# Altium schematic sheet PLD_Connectors.SchDoc: Connectors
size A3; SheetTotal: 32
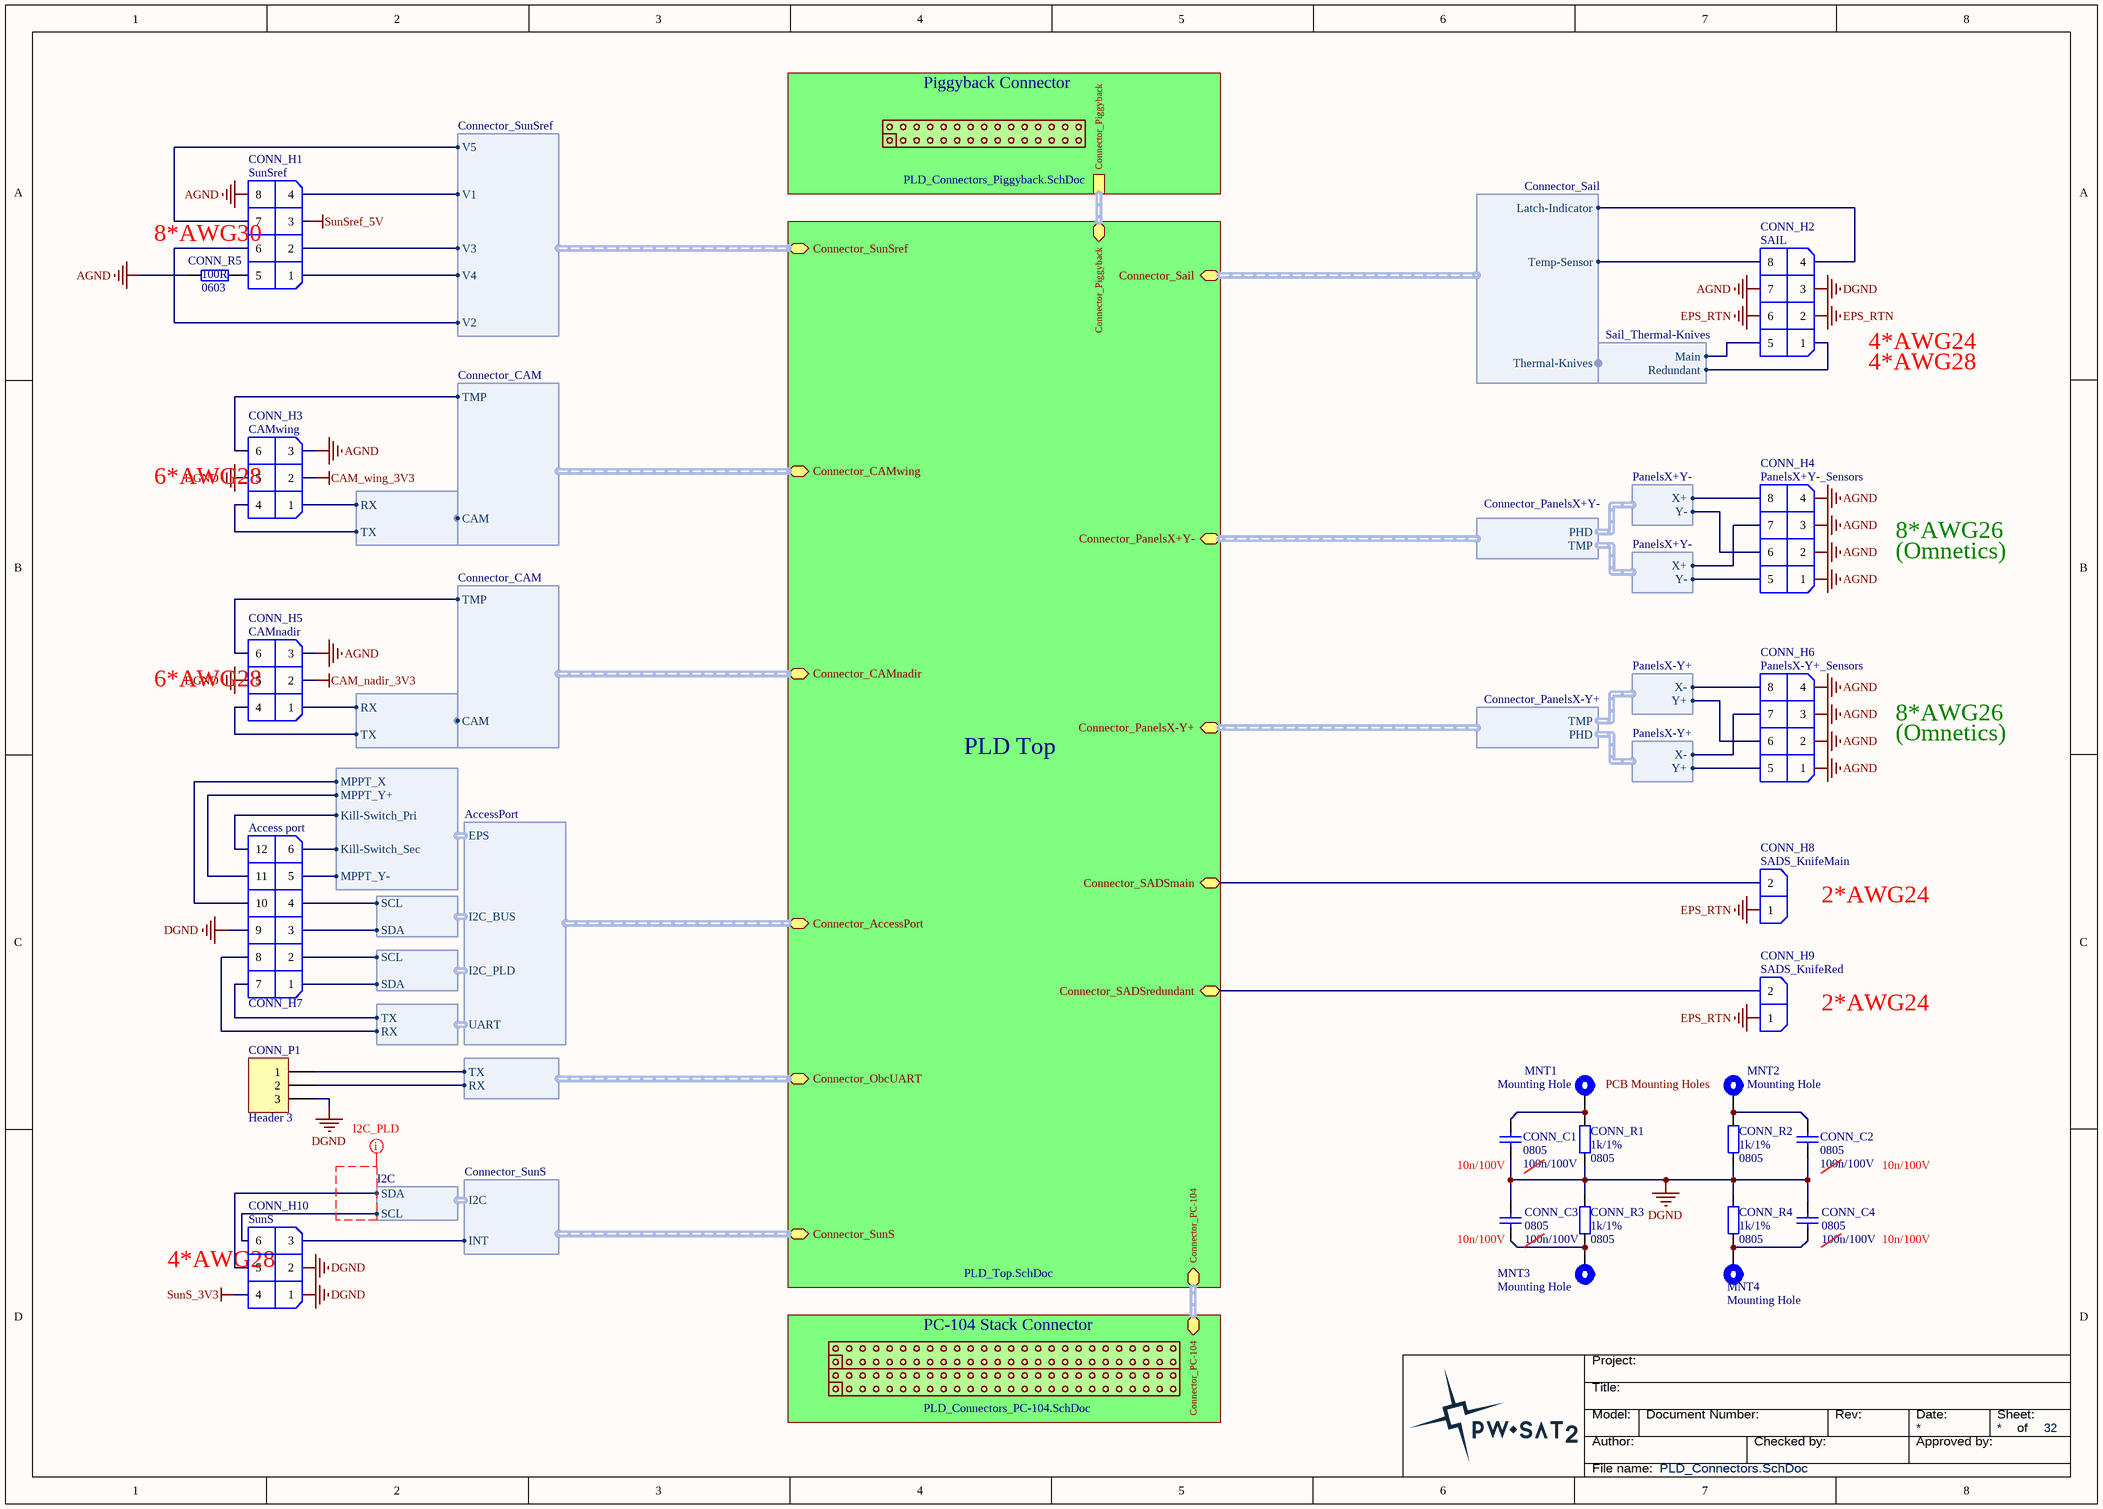
[diagram p0: PLD_Connectors.SchDoc]

## Parts
CONN_C1  Package: 0805  [SMD_Capacitor_0805]  (hidden comment: 100n/100V)
CONN_C2  Package: 0805  [SMD_Capacitor_0805]  (hidden comment: 100n/100V)
CONN_C3  Package: 0805  [SMD_Capacitor_0805]  (hidden comment: 100n/100V)
CONN_C4  Package: 0805  [SMD_Capacitor_0805]  (hidden comment: 100n/100V)
CONN_H1  SunSref  [Harwin_Datamate_L-Tek_M80-8670805]
CONN_H2  SAIL  [Harwin_Datamate_L-Tek_M80-8670805]
CONN_H3  CAMwing  [Harwin_Datamate_L-Tek_M80-8670605]
CONN_H4  PanelsX+Y-_Sensors  [Harwin_Datamate_L-Tek_M80-8670805]
CONN_H5  CAMnadir  [Harwin_Datamate_L-Tek_M80-8670605]
CONN_H6  PanelsX-Y+_Sensors  [Harwin_Datamate_L-Tek_M80-8670805]
CONN_H7  Access port  [Harwin_Datamate_L-Tek_M80-8411242]
CONN_H8  SADS_KnifeMain  [Harwin_Datamate_L-Tek_M80-8770222]
CONN_H9  SADS_KnifeRed  [Harwin_Datamate_L-Tek_M80-8770222]
CONN_H10  SunS  [Harwin_Datamate_L-Tek_M80-8670605]
CONN_P1  Header 3  [HEADER 1X3 FEMALE]
CONN_R1  Package: 0805  [SMD_Resistor_0805]  (hidden comment: 1k/1%)
CONN_R2  Package: 0805  [SMD_Resistor_0805]  (hidden comment: 1k/1%)
CONN_R3  Package: 0805  [SMD_Resistor_0805]  (hidden comment: 1k/1%)
CONN_R4  Package: 0805  [SMD_Resistor_0805]  (hidden comment: 1k/1%)
CONN_R5  Package: 0603  [SMD_Resistor_0603]  (hidden comment: 100R)
MNT1  Mounting Hole  [PC-104_PcbMntHole_M3]
MNT2  Mounting Hole  [PC-104_PcbMntHole_M3]
MNT3  Mounting Hole  [PC-104_PcbMntHole_M3]
MNT4  Mounting Hole  [PC-104_PcbMntHole_M3]

## Sub-sheets
PC-104 Stack Connector = PLD_Connectors_PC-104.SchDoc: Connector_PC-104 (harness Connector_PC-104)
Piggyback Connector = PLD_Connectors_Piggyback.SchDoc: Connector_Piggyback (harness Connector_Piggyback)
PLD Top = PLD_Top.SchDoc: Connector_Sail (harness Connector_Sail), Connector_PC-104 (harness Connector_PC-104), Connector_Piggyback (harness Connector_Piggyback), Connector_CAMnadir (harness Connector_CAM), Connector_PanelsX-Y+ (harness Connector_PanelsX-Y+), Connector_PanelsX+Y- (harness Connector_PanelsX+Y-), Connector_SunS (harness Connector_SunS), Connector_CAMwing (harness Connector_CAM), Connector_SADSmain, Connector_SADSredundant, Connector_SunSref (harness Connector_SunSref), Connector_AccessPort (harness AccessPort), Connector_ObcUART (harness UART)

## Harnesses
Connector_Sail: Latch-Indicator, Temp-Sensor, Thermal-Knives
Sail_Thermal-Knives: Main, Redundant
Connector_SunS: I2C, INT
I2C: SDA, SCL
CAM: TX, RX
Connector_CAM: CAM, TMP
Connector_PanelsX-Y+: PHD, TMP
PanelsX-Y+: X-, Y+
Connector_PanelsX+Y-: TMP, PHD
PanelsX+Y-: X+, Y-
Connector_SunSref: V1, V2, V3, V4, V5
AccessPort: I2C_PLD, I2C_BUS, EPS, UART
EPS_ACCESSPORT: MPPT_X, MPPT_Y+, MPPT_Y-, Kill-Switch_Pri, Kill-Switch_Sec
UART: RX, TX

## Nets
AGND: CONN_H1.8 CONN_H2.7 CONN_H3.3 CONN_H4.1 CONN_H4.2 CONN_H4.3 CONN_H4.4 CONN_H5.3 CONN_H6.1 CONN_H6.2 CONN_H6.3 CONN_H6.4 CONN_R5.1
CAM_nadir_3V3: CONN_H5.2
CAM_wing_3V3: CONN_H3.2
DGND: CONN_C1.1 CONN_C2.1 CONN_C3.2 CONN_C4.2 CONN_H2.3 CONN_H3.5 CONN_H5.5 CONN_H7.9 CONN_H10.1 CONN_H10.2 CONN_P1.3 CONN_R1.1 CONN_R2.1 CONN_R3.2 CONN_R4.2
EPS_RTN: CONN_H2.2 CONN_H2.6 CONN_H8.1 CONN_H9.1
SunS_3V3: CONN_H10.4
SunSref_5V: CONN_H1.3
NetCONN_C1_2: CONN_C1.2 CONN_R1.2 MNT1.1
NetCONN_C2_2: CONN_C2.2 CONN_R2.2 MNT2.1
NetCONN_C3_1: CONN_C3.1 CONN_R3.1 MNT3.1
NetCONN_C4_1: CONN_C4.1 CONN_R4.1 MNT4.1
NetCONN_H1_1: CONN_H1.1 ; sheet PLD Top/Connector_SunSref.V4
NetCONN_H1_2: CONN_H1.2 ; sheet PLD Top/Connector_SunSref.V3
NetCONN_H1_4: CONN_H1.4 ; sheet PLD Top/Connector_SunSref.V1
NetCONN_H1_5: CONN_H1.5 CONN_R5.2
NetCONN_H1_6: CONN_H1.6 ; sheet PLD Top/Connector_SunSref.V2
NetCONN_H1_7: CONN_H1.7 ; sheet PLD Top/Connector_SunSref.V5
NetCONN_H2_1: CONN_H2.1 ; harness Sail_Thermal-Knives.Redundant
NetCONN_H2_4: CONN_H2.4 ; sheet PLD Top/Connector_Sail.Latch-Indicator
NetCONN_H2_5: CONN_H2.5 ; harness Sail_Thermal-Knives.Main
NetCONN_H2_8: CONN_H2.8 ; sheet PLD Top/Connector_Sail.Temp-Sensor
NetCONN_H3_1: CONN_H3.1 ; harness CAM.RX
NetCONN_H3_4: CONN_H3.4 ; harness CAM.TX
NetCONN_H3_6: CONN_H3.6 ; sheet PLD Top/Connector_CAMwing.TMP
NetCONN_H4_5: CONN_H4.5 ; harness PanelsX+Y-.Y-
NetCONN_H4_6: CONN_H4.6 ; harness PanelsX+Y-.Y-
NetCONN_H4_7: CONN_H4.7 ; harness PanelsX+Y-.X+
NetCONN_H4_8: CONN_H4.8 ; harness PanelsX+Y-.X+
NetCONN_H5_1: CONN_H5.1 ; harness CAM.RX
NetCONN_H5_4: CONN_H5.4 ; harness CAM.TX
NetCONN_H5_6: CONN_H5.6 ; sheet PLD Top/Connector_CAMnadir.TMP
NetCONN_H6_5: CONN_H6.5 ; harness PanelsX-Y+.Y+
NetCONN_H6_6: CONN_H6.6 ; harness PanelsX-Y+.Y+
NetCONN_H6_7: CONN_H6.7 ; harness PanelsX-Y+.X-
NetCONN_H6_8: CONN_H6.8 ; harness PanelsX-Y+.X-
NetCONN_H7_1: CONN_H7.1 ; harness I2C.SDA
NetCONN_H7_2: CONN_H7.2 ; harness I2C.SCL
NetCONN_H7_3: CONN_H7.3 ; harness I2C.SDA
NetCONN_H7_4: CONN_H7.4 ; harness I2C.SCL
NetCONN_H7_5: CONN_H7.5 ; harness EPS_ACCESSPORT.MPPT_Y-
NetCONN_H7_6: CONN_H7.6 ; harness EPS_ACCESSPORT.Kill-Switch_Sec
NetCONN_H7_7: CONN_H7.7 ; harness UART.TX
NetCONN_H7_8: CONN_H7.8 ; harness UART.RX
NetCONN_H7_10: CONN_H7.10 ; harness EPS_ACCESSPORT.MPPT_X
NetCONN_H7_11: CONN_H7.11 ; harness EPS_ACCESSPORT.MPPT_Y+
NetCONN_H7_12: CONN_H7.12 ; harness EPS_ACCESSPORT.Kill-Switch_Pri
NetCONN_H8_2: CONN_H8.2 ; sheet PLD Top/Connector_SADSmain
NetCONN_H9_2: CONN_H9.2 ; sheet PLD Top/Connector_SADSredundant
NetCONN_H10_3: CONN_H10.3 ; sheet PLD Top/Connector_SunS.INT
NetCONN_H10_5: CONN_H10.5 ; harness I2C.SDA
NetCONN_H10_6: CONN_H10.6 ; harness I2C.SCL
NetCONN_P1_1: CONN_P1.1 ; sheet PLD Top/Connector_ObcUART.TX
NetCONN_P1_2: CONN_P1.2 ; sheet PLD Top/Connector_ObcUART.RX

## Buses and harness runs
harness sheet PC-104 Stack Connector/Connector_PC-104 = sheet PLD Top/Connector_PC-104
harness sheet Piggyback Connector/Connector_Piggyback = sheet PLD Top/Connector_Piggyback

## Layout directives
net class I2C_PLD: (no net found under the mark)

## Notes on the sheet
- 8*AWG30
- 4*AWG24
- 4*AWG28
- 6*AWG28
- 8*AWG26
- (Omnetics)
- 2*AWG24
- PCB Mounting Holes
- (near CONN_C1) 10n/100V
- 10n/100V
- (near CONN_C3) 10n/100V
- Title:
- Project:
- Author:
- Model:
- Document Number:
- Checked by:
- Rev:
- Date:
- Approved by:
- Sheet:
- of
- File name:

## Library data of the parts
CONN_C1-CONN_C4 = Cer_C0805T104K1RCLTU: Ceramic Cap Kemet COTS 100n/100V X7R 0805; ManufacturerPartNumber: C0805T104K1RCLTU; Manufacturer: Kemet; Value: 100n/100V
CONN_H1 CONN_H2 CONN_H4 CONN_H6 = Harwin_Datamate_L-Tek_2x4pin: Harwin DataMate L-Tek, 2mm pitch, 2x4pin.; Value: Harwin DataMate L-Tek 2x4pin
CONN_H3 CONN_H5 CONN_H10 = Harwin_Datamate_L-Tek_2x3pin: Harwin DataMate L-Tek, 2mm pitch, 2x3pin.; Value: Harwin DataMate L-Tek 2x3pin
CONN_H7 = Harwin_Datamate_L-Tek_2x6pin: Harwin DataMate L-Tek, 2mm pitch, 2x6pin.; Value: Harwin DataMate L-Tek 2x6pin
CONN_H8 CONN_H9 = Harwin_Datamate_L-Tek_1x2pin: Harwin DataMate L-Tek, 2mm pitch, 1x2pin.; Value: Harwin DataMate L-Tek 1x2pin
CONN_P1 = Header 3: Header, 3-Pin; LatestRevisionDate: 17-Jul-2002; LatestRevisionNote: Re-released for DXP Platform.; Publisher: Altium Limited
CONN_R1-CONN_R4 = CRCW08051K00FKxxxx: 1k/1% Vishay CRCW 0805 Resistor. 125mW, 100ppm, 150V.; Manufacturer: Vishay; ManufacturerPartNumber: CRCW08051K00FKxxxx; Value: 1k/1%
CONN_R5 = Res: Value: 100R
MNT1-MNT4 = MntHole: PCB Mounting Hole; Value: Mounting Hole